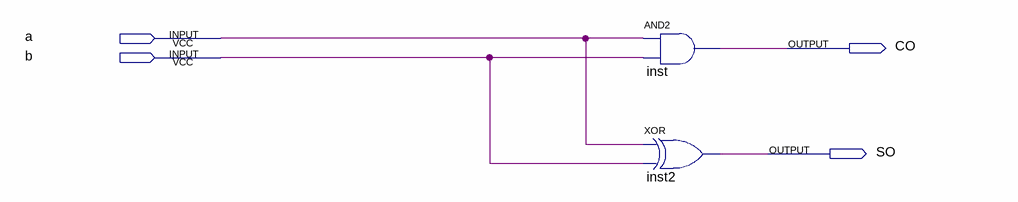
[diagram p0: schematic sheet]
// Quartus schematic lab201.bdf as structural Verilog: 2 symbols, 4 pins
module lab201 (
  input  a,
  input  b,
  output CO,
  output SO
);

  and inst (CO, a, b);
  xor inst2 (SO, a, b);
endmodule
